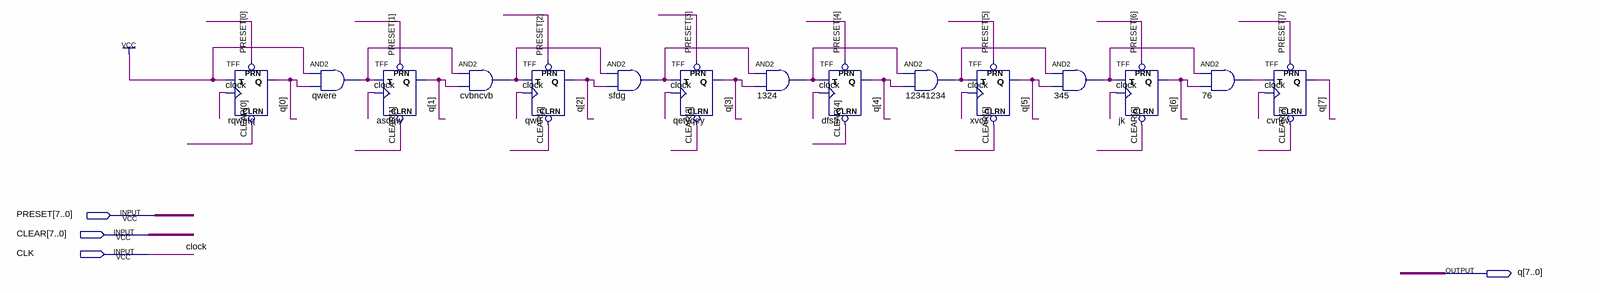
[diagram p0: schematic sheet]
// Quartus schematic contador.bdf as structural Verilog: 15 symbols, 4 pins
module contador (
  input  [7:0] PRESET,
  input  [7:0] CLEAR,
  input  CLK,
  output [7:0] q
);

  wire cvbncvb_out, n76_out, n345_out, n1324_out, n12341234_out, qwere_out, sfdg_out;

  TFF rqwetq (.PRN(PRESET[0]), .CLRN(CLEAR[0]), .T(1'b1), .CLK(CLK), .Q(q[0]));
  and qwere (qwere_out, 1'b1, q[0]);
  TFF asdqw (.PRN(PRESET[1]), .CLRN(CLEAR[1]), .T(qwere_out), .CLK(CLK), .Q(q[1]));
  and cvbncvb (cvbncvb_out, qwere_out, q[1]);
  TFF qwe (.PRN(PRESET[2]), .CLRN(CLEAR[2]), .T(cvbncvb_out), .CLK(CLK), .Q(q[2]));
  and sfdg (sfdg_out, cvbncvb_out, q[2]);
  TFF qetyqey (.PRN(PRESET[3]), .CLRN(CLEAR[3]), .T(sfdg_out), .CLK(CLK), .Q(q[3]));
  and u_1324 (n1324_out, sfdg_out, q[3]);
  TFF dfsa (.PRN(PRESET[4]), .CLRN(CLEAR[4]), .T(n1324_out), .CLK(CLK), .Q(q[4]));
  and u_12341234 (n12341234_out, n1324_out, q[4]);
  TFF xvcz (.PRN(PRESET[5]), .CLRN(CLEAR[5]), .T(n12341234_out), .CLK(CLK), .Q(q[5]));
  and u_345 (n345_out, n12341234_out, q[5]);
  TFF jk (.PRN(PRESET[6]), .CLRN(CLEAR[6]), .T(n345_out), .CLK(CLK), .Q(q[6]));
  and u_76 (n76_out, n345_out, q[6]);
  TFF cvncv (.PRN(PRESET[7]), .CLRN(CLEAR[7]), .T(n76_out), .CLK(CLK), .Q(q[7]));

  // Other names for the same wires on the sheet: clock = CLK
endmodule
